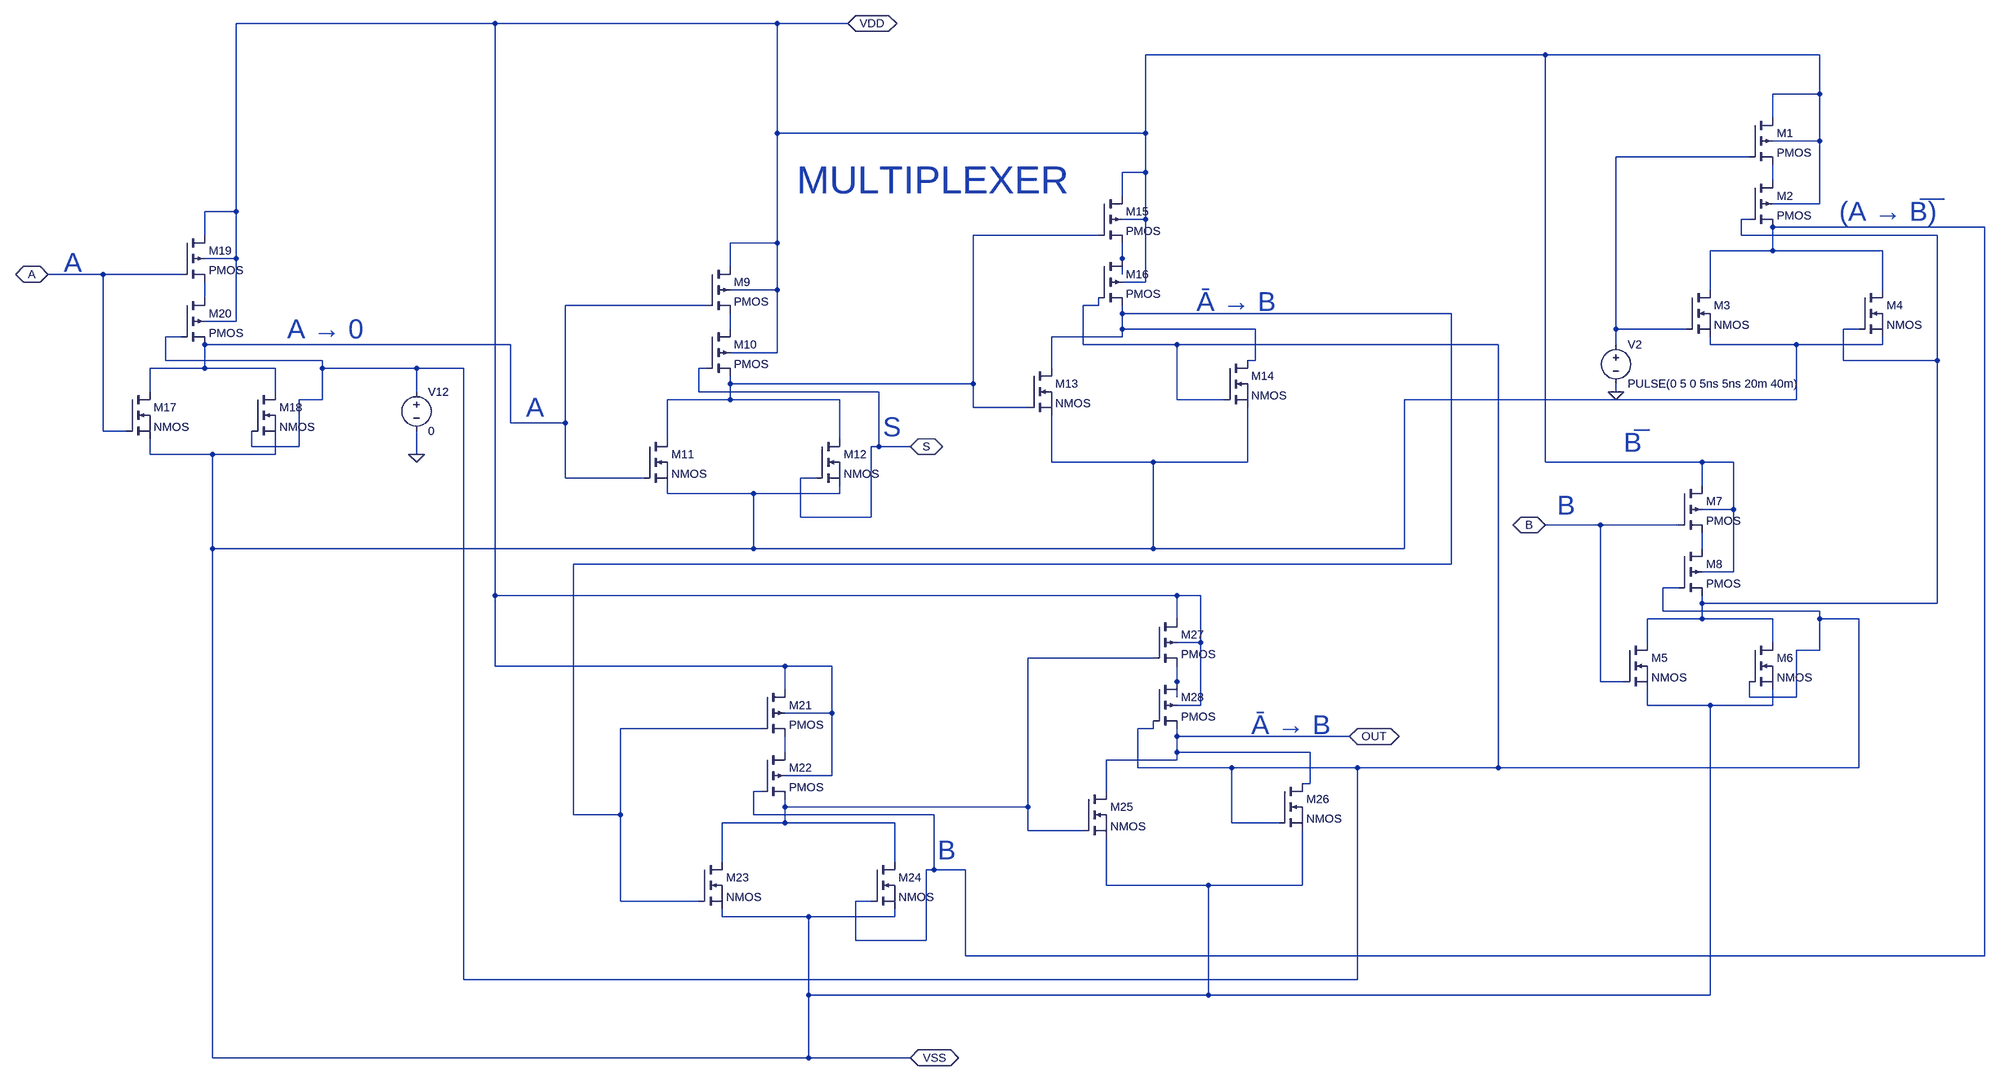
[diagram p0: schematic multiplexerimply.asc]
multiplexerimply.asc, the LTspice schematic file:
Version 4
SHEET 1 1844 1208
WIRE -1200 -976 -1728 -976
WIRE -624 -976 -1200 -976
WIRE -480 -976 -624 -976
WIRE 944 -912 128 -912
WIRE 1504 -912 944 -912
WIRE 1504 -832 1504 -912
WIRE 1504 -832 1408 -832
WIRE 1408 -784 1408 -832
WIRE -624 -752 -624 -976
WIRE 128 -752 128 -912
WIRE 128 -752 -624 -752
WIRE 1504 -736 1504 -832
WIRE 1504 -736 1408 -736
WIRE 1360 -704 1088 -704
WIRE 128 -672 128 -752
WIRE 128 -672 80 -672
WIRE 1408 -656 1408 -688
WIRE 80 -624 80 -672
WIRE 1504 -608 1504 -736
WIRE 1504 -608 1408 -608
WIRE -1728 -592 -1728 -976
WIRE -1728 -592 -1792 -592
WIRE 128 -576 128 -672
WIRE 128 -576 80 -576
WIRE 1360 -576 1344 -576
WIRE 1840 -560 1408 -560
WIRE -1792 -544 -1792 -592
WIRE 32 -544 -224 -544
WIRE 1344 -544 1344 -576
WIRE 1744 -544 1344 -544
WIRE -624 -528 -624 -752
WIRE -624 -528 -720 -528
WIRE 1408 -512 1408 -560
WIRE 1408 -512 1280 -512
WIRE 1632 -512 1408 -512
WIRE -1728 -496 -1728 -592
WIRE -1728 -496 -1792 -496
WIRE 80 -496 80 -528
WIRE -720 -480 -720 -528
WIRE -2000 -464 -2112 -464
WIRE -1840 -464 -2000 -464
WIRE 80 -464 80 -496
WIRE 128 -448 128 -576
WIRE 128 -448 80 -448
WIRE -624 -432 -624 -528
WIRE -624 -432 -720 -432
WIRE 1280 -432 1280 -512
WIRE 1632 -432 1632 -512
WIRE -1792 -416 -1792 -448
WIRE -768 -400 -1056 -400
WIRE 32 -400 32 -416
WIRE 32 -400 0 -400
WIRE 80 -384 80 -400
WIRE 752 -384 80 -384
WIRE -1728 -368 -1728 -496
WIRE -1728 -368 -1792 -368
WIRE -720 -352 -720 -384
WIRE 80 -352 80 -384
WIRE 352 -352 80 -352
WIRE 1088 -352 1088 -704
WIRE 1232 -352 1088 -352
WIRE 1584 -352 1552 -352
WIRE -1840 -336 -1872 -336
WIRE 80 -336 80 -352
WIRE 80 -336 -64 -336
WIRE -1168 -320 -1792 -320
WIRE 0 -320 0 -400
WIRE 192 -320 0 -320
WIRE 848 -320 192 -320
WIRE 1088 -320 1088 -352
WIRE 1280 -320 1280 -336
WIRE 1456 -320 1280 -320
WIRE 1632 -320 1632 -336
WIRE 1632 -320 1456 -320
WIRE -624 -304 -624 -432
WIRE -624 -304 -720 -304
WIRE -1872 -288 -1872 -336
WIRE -1552 -288 -1872 -288
WIRE 352 -288 352 -352
WIRE 352 -288 336 -288
WIRE 1552 -288 1552 -352
WIRE 1744 -288 1744 -544
WIRE 1744 -288 1552 -288
WIRE -1792 -272 -1792 -320
WIRE -1792 -272 -1904 -272
WIRE -1648 -272 -1792 -272
WIRE -1552 -272 -1552 -288
WIRE -1360 -272 -1552 -272
WIRE -1264 -272 -1360 -272
WIRE -768 -272 -784 -272
WIRE -64 -272 -64 -336
WIRE -720 -240 -720 -256
WIRE -224 -240 -224 -544
WIRE -224 -240 -720 -240
WIRE -1904 -224 -1904 -272
WIRE -1648 -224 -1648 -272
WIRE -1360 -224 -1360 -272
WIRE -784 -224 -784 -272
WIRE -416 -224 -784 -224
WIRE 1088 -224 1088 -240
WIRE -1552 -208 -1552 -272
WIRE -1552 -208 -1600 -208
WIRE -720 -208 -720 -240
WIRE -720 -208 -848 -208
WIRE -496 -208 -720 -208
WIRE 192 -208 192 -320
WIRE 288 -208 192 -208
WIRE 1456 -208 1456 -320
WIRE 1456 -208 656 -208
WIRE -224 -192 -224 -240
WIRE -112 -192 -224 -192
WIRE -1168 -160 -1168 -320
WIRE -1056 -160 -1056 -400
WIRE -1056 -160 -1168 -160
WIRE -2000 -144 -2000 -464
WIRE -1952 -144 -2000 -144
WIRE -848 -128 -848 -208
WIRE -496 -128 -496 -208
WIRE -1696 -112 -1696 -144
WIRE -1600 -112 -1600 -208
WIRE -1600 -112 -1696 -112
WIRE -416 -112 -416 -224
WIRE -416 -112 -432 -112
WIRE -352 -112 -416 -112
WIRE -1904 -96 -1904 -128
WIRE -1776 -96 -1904 -96
WIRE -1648 -96 -1648 -128
WIRE -1648 -96 -1776 -96
WIRE -1360 -96 -1360 -144
WIRE -64 -80 -64 -176
WIRE 144 -80 -64 -80
WIRE 336 -80 336 -192
WIRE 336 -80 144 -80
WIRE 944 -80 944 -912
WIRE 1264 -80 944 -80
WIRE 1328 -80 1264 -80
WIRE -1056 -48 -1056 -160
WIRE -896 -48 -1056 -48
WIRE -544 -48 -576 -48
WIRE 1264 -32 1264 -80
WIRE -848 -16 -848 -32
WIRE -672 -16 -848 -16
WIRE -496 -16 -496 -32
WIRE -496 -16 -672 -16
WIRE 1328 16 1328 -80
WIRE 1328 16 1264 16
WIRE -576 32 -576 -48
WIRE -432 32 -432 -112
WIRE -432 32 -576 32
WIRE 1056 48 944 48
WIRE 1216 48 1056 48
WIRE -1776 96 -1776 -96
WIRE -672 96 -672 -16
WIRE -672 96 -1776 96
WIRE 144 96 144 -80
WIRE 144 96 -672 96
WIRE 656 96 656 -208
WIRE 656 96 144 96
WIRE 1264 96 1264 64
WIRE 752 128 752 -384
WIRE 752 128 -1040 128
WIRE 1328 144 1328 16
WIRE 1328 144 1264 144
WIRE 1216 176 1184 176
WIRE -1200 192 -1200 -976
WIRE 192 192 -1200 192
WIRE 240 192 192 192
WIRE 1264 208 1264 192
WIRE 1744 208 1744 -288
WIRE 1744 208 1264 208
WIRE 1184 224 1184 176
WIRE 1504 224 1184 224
WIRE 192 240 192 192
WIRE 1264 240 1264 208
WIRE 1264 240 1152 240
WIRE 1408 240 1264 240
WIRE 1504 240 1504 224
WIRE 1584 240 1504 240
WIRE 240 288 240 192
WIRE 240 288 192 288
WIRE 1152 288 1152 240
WIRE 1408 288 1408 240
WIRE 1504 304 1504 240
WIRE 1504 304 1456 304
WIRE 144 320 -112 320
WIRE -1200 336 -1200 192
WIRE -608 336 -1200 336
WIRE -512 336 -608 336
WIRE 192 368 192 336
WIRE 1056 368 1056 48
WIRE 1104 368 1056 368
WIRE -608 384 -608 336
WIRE 192 400 192 368
WIRE 1360 400 1360 368
WIRE 1456 400 1456 304
WIRE 1456 400 1360 400
WIRE 240 416 240 288
WIRE 240 416 192 416
WIRE 1152 416 1152 384
WIRE 1280 416 1152 416
WIRE 1408 416 1408 384
WIRE 1408 416 1280 416
WIRE -512 432 -512 336
WIRE -512 432 -608 432
WIRE -656 464 -944 464
WIRE 144 464 144 448
WIRE 144 464 112 464
WIRE 192 480 192 464
WIRE 544 480 192 480
WIRE -608 512 -608 480
WIRE 192 512 192 480
WIRE 464 512 192 512
WIRE 192 528 192 512
WIRE 192 528 48 528
WIRE 112 544 112 464
WIRE 304 544 112 544
WIRE 560 544 304 544
WIRE 848 544 848 -320
WIRE 848 544 560 544
WIRE 1584 544 1584 240
WIRE 1584 544 848 544
WIRE -512 560 -512 432
WIRE -512 560 -608 560
WIRE 464 576 464 512
WIRE 464 576 448 576
WIRE -656 592 -672 592
WIRE 48 592 48 528
WIRE -608 624 -608 608
WIRE -112 624 -112 320
WIRE -112 624 -608 624
WIRE -1040 640 -1040 128
WIRE -944 640 -944 464
WIRE -944 640 -1040 640
WIRE -672 640 -672 592
WIRE -304 640 -672 640
WIRE -608 656 -608 624
WIRE -608 656 -736 656
WIRE -384 656 -608 656
WIRE 304 656 304 544
WIRE 400 656 304 656
WIRE -112 672 -112 624
WIRE 0 672 -112 672
WIRE -736 736 -736 656
WIRE -384 736 -384 656
WIRE -304 752 -304 640
WIRE -304 752 -320 752
WIRE -240 752 -304 752
WIRE 48 784 48 688
WIRE 256 784 48 784
WIRE 448 784 448 672
WIRE 448 784 256 784
WIRE -944 816 -944 640
WIRE -784 816 -944 816
WIRE -432 816 -464 816
WIRE -736 848 -736 832
WIRE -560 848 -736 848
WIRE -384 848 -384 832
WIRE -384 848 -560 848
WIRE -464 896 -464 816
WIRE -320 896 -320 752
WIRE -320 896 -464 896
WIRE -240 928 -240 752
WIRE 1840 928 1840 -560
WIRE 1840 928 -240 928
WIRE -1264 976 -1264 -272
WIRE 560 976 560 544
WIRE 560 976 -1264 976
WIRE -560 1008 -560 848
WIRE 256 1008 256 784
WIRE 256 1008 -560 1008
WIRE 1280 1008 1280 416
WIRE 1280 1008 256 1008
WIRE -1776 1136 -1776 96
WIRE -560 1136 -560 1008
WIRE -560 1136 -1776 1136
WIRE -352 1136 -560 1136
FLAG 1088 -224 0
FLAG -1360 -96 0
FLAG 544 480 OUT
IOPIN 544 480 BiDir
FLAG -2112 -464 A
IOPIN -2112 -464 BiDir
FLAG -480 -976 VDD
IOPIN -480 -976 BiDir
FLAG -352 -112 S
IOPIN -352 -112 BiDir
FLAG -352 1136 VSS
IOPIN -352 1136 BiDir
FLAG 944 48 B
IOPIN 944 48 BiDir
SYMBOL pmos4 1360 -784 R0
SYMATTR InstName M1
SYMBOL pmos4 1360 -656 R0
SYMATTR InstName M2
SYMBOL nmos 1232 -432 R0
SYMATTR InstName M3
SYMBOL nmos 1584 -432 R0
SYMATTR InstName M4
SYMBOL voltage 1088 -336 R0
WINDOW 123 0 0 Left 0
WINDOW 39 0 0 Left 0
SYMATTR InstName V2
SYMATTR Value PULSE(0 5 0 5ns 5ns 20m 40m)
SYMBOL nmos 1104 288 R0
SYMATTR InstName M5
SYMBOL nmos 1360 288 R0
SYMATTR InstName M6
SYMBOL pmos4 1216 -32 R0
SYMATTR InstName M7
SYMBOL pmos4 1216 96 R0
SYMATTR InstName M8
SYMBOL pmos4 -768 -480 R0
SYMATTR InstName M9
SYMBOL pmos4 -768 -352 R0
SYMATTR InstName M10
SYMBOL nmos -896 -128 R0
SYMATTR InstName M11
SYMBOL nmos -544 -128 R0
SYMATTR InstName M12
SYMBOL nmos -112 -272 R0
SYMATTR InstName M13
SYMBOL nmos 288 -288 R0
SYMATTR InstName M14
SYMBOL pmos4 32 -624 R0
SYMATTR InstName M15
SYMBOL pmos4 32 -496 R0
SYMATTR InstName M16
SYMBOL nmos -1952 -224 R0
SYMATTR InstName M17
SYMBOL voltage -1360 -240 R0
WINDOW 123 0 0 Left 0
WINDOW 39 0 0 Left 0
SYMATTR InstName V12
SYMATTR Value 0
SYMBOL nmos -1696 -224 R0
SYMATTR InstName M18
SYMBOL pmos4 -1840 -544 R0
SYMATTR InstName M19
SYMBOL pmos4 -1840 -416 R0
SYMATTR InstName M20
SYMBOL pmos4 -656 384 R0
SYMATTR InstName M21
SYMBOL pmos4 -656 512 R0
SYMATTR InstName M22
SYMBOL nmos -784 736 R0
SYMATTR InstName M23
SYMBOL nmos -432 736 R0
SYMATTR InstName M24
SYMBOL nmos 0 592 R0
SYMATTR InstName M25
SYMBOL nmos 400 576 R0
SYMATTR InstName M26
SYMBOL pmos4 144 240 R0
SYMATTR InstName M27
SYMBOL pmos4 144 368 R0
SYMATTR InstName M28
TEXT 1104 -120 Left 5 ;B̅
TEXT 1544 -592 Left 5 ;(A → B̅)̅
TEXT 968 8 Left 5 ;B
TEXT -1136 -192 Left 5 ;A
TEXT -408 -152 Left 5 ;S
TEXT 232 -408 Left 5 ;Ā → B
TEXT -2080 -488 Left 5 ;A
TEXT -1624 -352 Left 5 ;A → 0
TEXT -296 712 Left 5 ;B
TEXT 344 456 Left 5 ;Ā → B
TEXT -584 -656 Left 6 ;MULTIPLEXER

The netlist it stands for:
* multiplexerimply.asc
M1 VDD N001 N002 VDD PMOS
M2 N002 N003 N004 VDD PMOS
M3 N004 N001 VSS VSS NMOS
M4 N004 N003 VSS VSS NMOS
V2 N001 0 PULSE(0 5 0 5ns 5ns 20m 40m)
M5 N003 B VSS VSS NMOS
M6 N003 N009 VSS VSS NMOS
M7 VDD B N012 VDD PMOS
M8 N012 N009 N003 VDD PMOS
M9 VDD N008 N011 VDD PMOS
M10 N011 S N005 VDD PMOS
M11 N005 N008 VSS VSS NMOS
M12 N005 S VSS VSS NMOS
M13 N010 N005 VSS VSS NMOS
M14 N010 N009 VSS VSS NMOS
M15 VDD N005 N006 VDD PMOS
M16 N006 N009 N010 VDD PMOS
M17 N008 A VSS VSS NMOS
V12 N009 0 0
M18 N008 N009 VSS VSS NMOS
M19 VDD A N007 VDD PMOS
M20 N007 N009 N008 VDD PMOS
M21 VDD N010 N015 VDD PMOS
M22 N015 N004 N013 VDD PMOS
M23 N013 N010 VSS VSS NMOS
M24 N013 N004 VSS VSS NMOS
M25 OUT N013 VSS VSS NMOS
M26 OUT N009 VSS VSS NMOS
M27 VDD N013 N014 VDD PMOS
M28 N014 N009 OUT VDD PMOS
.model NMOS NMOS
.model PMOS PMOS
.lib standard.mos
* B̅
* (A → B̅)̅
* B
* A
* S
* Ā → B
* A
* A → 0
* B
* Ā → B
* MULTIPLEXER
.backanno
.end